# EAGLE design Antilog-NPNO (EAGLE 9.0.1)
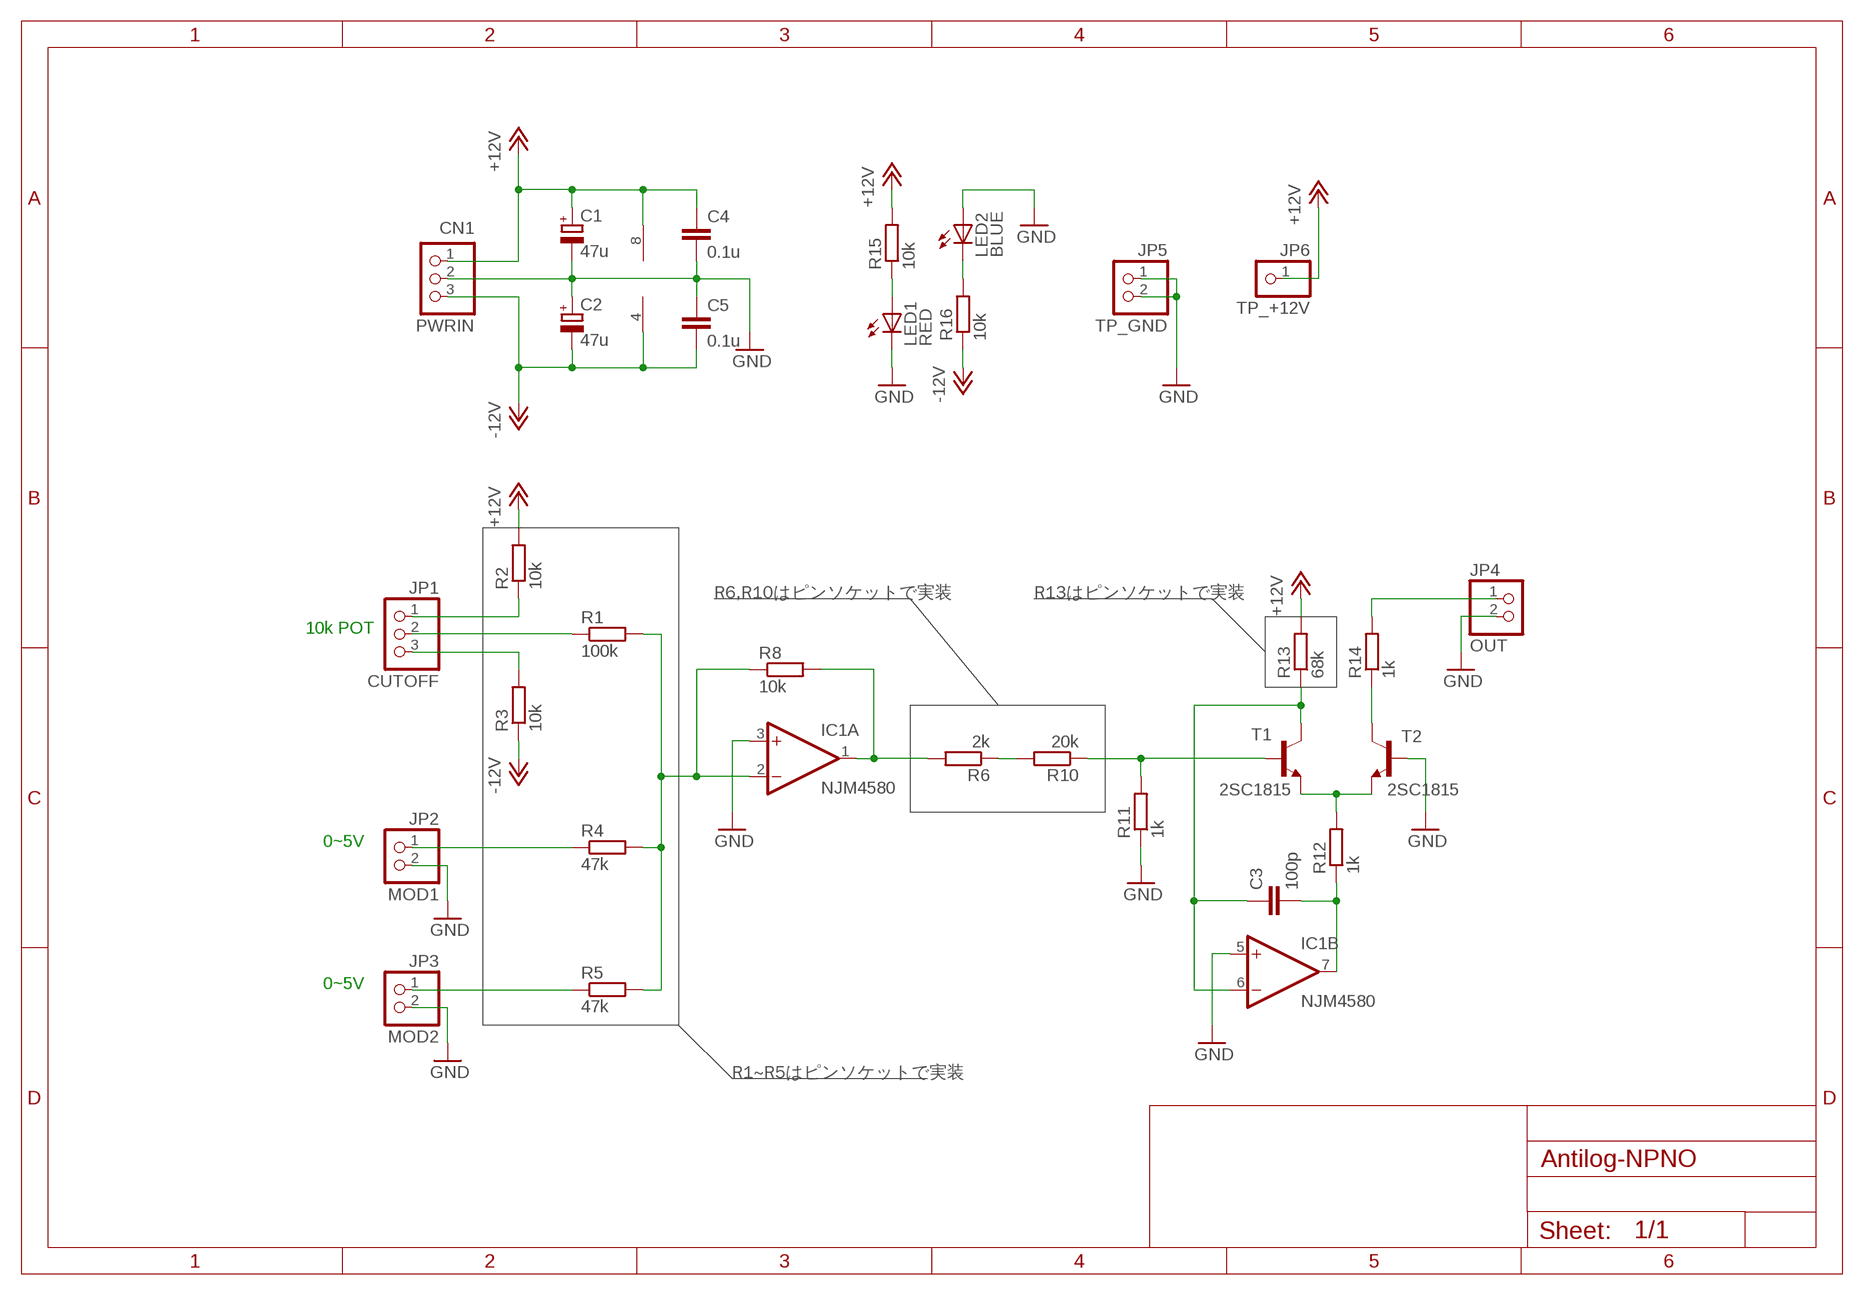
[diagram p0: schematic, sheet 1]

## Parts
C1  47u  CPOL-EUE2.5-6  [E2,5-6]
C2  47u  CPOL-EUE2.5-6  [E2,5-6]
C3  100p  C-EU050-024X044  [C050-024X044]
C4  0.1u  C-EU025-024X044  [C025-024X044]
C5  0.1u  C-EU025-024X044  [C025-024X044]
CN1  PWRIN  B3B-XH-A  [B3B-XH-A]
IC1  NJM4580  LM4558N  [DIL08]
JP1  CUTOFF  PINHD-1X3  [1X03]
JP2  MOD1  PINHD-1X2  [1X02]
JP3  MOD2  PINHD-1X2  [1X02]
JP4  OUT  PINHD-1X2  [1X02]
JP5  TP_GND  PINHD-1X2  [1X02]
JP6  TP_+12V  PINHD-1X1  [1X01]
LED1  RED  LED3MM  [LED3MM]
LED2  BLUE  LED3MM  [LED3MM]
R1  100k  R-EU_0207/7  [0207/7]
R2  10k  R-EU_0207/7  [0207/7]
R3  10k  R-EU_0207/7  [0207/7]
R4  47k  R-EU_0207/7  [0207/7]
R5  47k  R-EU_0207/7  [0207/7]
R6  2k  R-EU_0207/7  [0207/7]
R8  10k  R-EU_0207/7  [0207/7]
R10  20k  R-EU_0207/7  [0207/7]
R11  1k  R-EU_0207/7  [0207/7]
R12  1k  R-EU_0207/7  [0207/7]
R13  68k  R-EU_0207/7  [0207/7]
R14  1k  R-EU_0207/7  [0207/7]
R15  10k  R-EU_0207/7  [0207/7]
R16  10k  R-EU_0207/7  [0207/7]
T1  2SC1815  BC368-NPN-TO92-ECB  [TO92-ECB]
T2  2SC1815  BC368-NPN-TO92-ECB  [TO92-ECB]

## Nets
+12V: C1.+ C4.1 CN1.1 IC1.8(P:V+) JP6.1 R2.2 R13.2 R15.2
-12V: C2.- C5.2 CN1.3 IC1.4(P:V-) R3.1 R16.1
GND: C1.- C2.+ C4.2 C5.1 CN1.2 IC1.3(A:+IN) IC1.5(B:+IN) JP2.2 JP3.2 JP4.2 JP5.1 JP5.2 LED1.K(C) LED2.A R11.1 T2.B
N$1: JP3.1 R5.1
N$2: R10.1 R11.2 T1.B
N$3: JP1.2 R1.1
N$4: JP2.1 R4.1
N$5: IC1.1(A:OUT) R6.2 R8.2
N$6: R6.1 R10.2
N$7: JP1.1 R2.1
N$8: JP1.3 R3.2
N$9: IC1.2(A:-IN) R1.2 R4.2 R5.2 R8.1
N$10: R14.1 T2.C
N$11: LED1.A R15.1
N$13: JP4.1 R14.2
N$15: R12.2 T1.E T2.E
N$16: C3.2 IC1.7(B:OUT) R12.1
N$17: C3.1 IC1.6(B:-IN) R13.1 T1.C
N$19: LED2.K(C) R16.2

## Notes on the sheet
- R6,R10はピンソケットで実装 | R13はピンソケットで実装
- 10k POT
- 0~5V
- 0~5V
- R1~R5はピンソケットで実装

## Library data of the parts
C1 C2 = rcl:CPOL-EU: POLARIZED CAPACITOR, European symbol; SPICEPREFIX: C
C3-C5 = rcl:C-EU: CAPACITOR, European symbol; SPICEPREFIX: C
CN1 = jst-xh:B3B-XH-A: Wire-to-Board 2.5mm pitch top mount connector Source: http://www.jst-mfg.com/product/pdf/jpn/XH.pdf http://www.jst-mfg.com/product/detail.php?series=277
IC1 = linear:*4558: OP AMP
JP1 = pinhead:PINHD-1X3: PIN HEADER
JP2-JP5 = pinhead:PINHD-1X2: PIN HEADER
JP6 = pinhead:PINHD-1X1: PIN HEADER
LED1 LED2 = led:LED: LED OSRAM: - CHIPLED LG R971, LG N971, LY N971, LG Q971, LY Q971, LO R971, LY R971 LH N974, LH R974 LS Q976, LO Q976, LY Q976 LO Q996 - Hyper CHIPLED LW Q18S LB Q993, LB Q99A, LB R99A - SideLED LS A670, LO A670, LY A670, LG A670, LP A670 LB A673, LV A673, LT A673, LW A673 LH A674 LY A675 LS A676, LA A676, LO A676, LY A676, LW A676 LS A679, LY A679, LG A679 - Hyper Micro SIDELED® LS Y876, LA Y876, LO Y876, LY Y876 LT Y87S - SmartLED LW L88C, LW L88S LB L89C, LB L89S, LG L890 LS L89K, LO L89K, LY L89K LS L896, LA L896, LO L896, LY L896 - TOPLED LS T670, LO T670, LY T670, LG T670, LP T670 LSG T670, LSP T670, LSY T670, LOP T670, LYG T670 LG T671, LOG T671, LSG T671 LB T673, LV T673, LT T673, LW T673 LH T674 LS T676, LA T676, LO T676, LY T676, LB T676, LH T676, LSB T676, LW T676 LB T67C, LV T67C, LT T67C, LS T67K, LO T67K, LY T67K, LW E67C LS E67B, LA E67B, LO E67B, LY E67B, LB E67C, LV E67C, LT E67C LW T67C LS T679, LY T679, LG T679 LS T770, LO T770, LY T770, LG T770, LP T770 LB T773, LV T773, LT T773, LW T773 LH T774 LS E675, LA E675, LY E675, LS T675 LS T776, LA T776, LO T776, LY T776, LB T776 LHGB T686 LT T68C, LB T68C - Hyper Mini TOPLED® LB M676 - Mini TOPLED Santana® LG M470 LS M47K, LO M47K, LY M47K Source: http://www.osram.convergy.de LUXEON: - LUMILED® LXK2-PW12-R00, LXK2-PW12-S00, LXK2-PW14-U00, LXK2-PW14-V00 LXK2-PM12-R00, LXK2-PM12-S00, LXK2-PM14-U00 LXK2-PE12-Q00, LXK2-PE12-R00, LXK2-PE12-S00, LXK2-PE14-T00, LXK2-PE14-U00 LXK2-PB12-K00, LXK2-PB12-L00, LXK2-PB12-M00, LXK2-PB14-N00, LXK2-PB14-P00, LXK2-PB14-Q00 LXK2-PR12-L00, LXK2-PR12-M00, LXK2-PR14-Q00, LXK2-PR14-R00 LXK2-PD12-Q00, LXK2-PD12-R00, LXK2-PD12-S00 LXK2-PH12-R00, LXK2-PH12-S00 LXK2-PL12-P00, LXK2-PL12-Q00, LXK2-PL12-R00 Source: www.luxeon.com KINGBRIGHT: KA-3528ASYC Source: www.kingbright.com
R1-R6 R8 R10-R16 = rcl:R-EU_: RESISTOR, European symbol; SPICEPREFIX: R
T1 T2 = transistor-neu-to92:*-NPN-: NPN Transistror

## Board
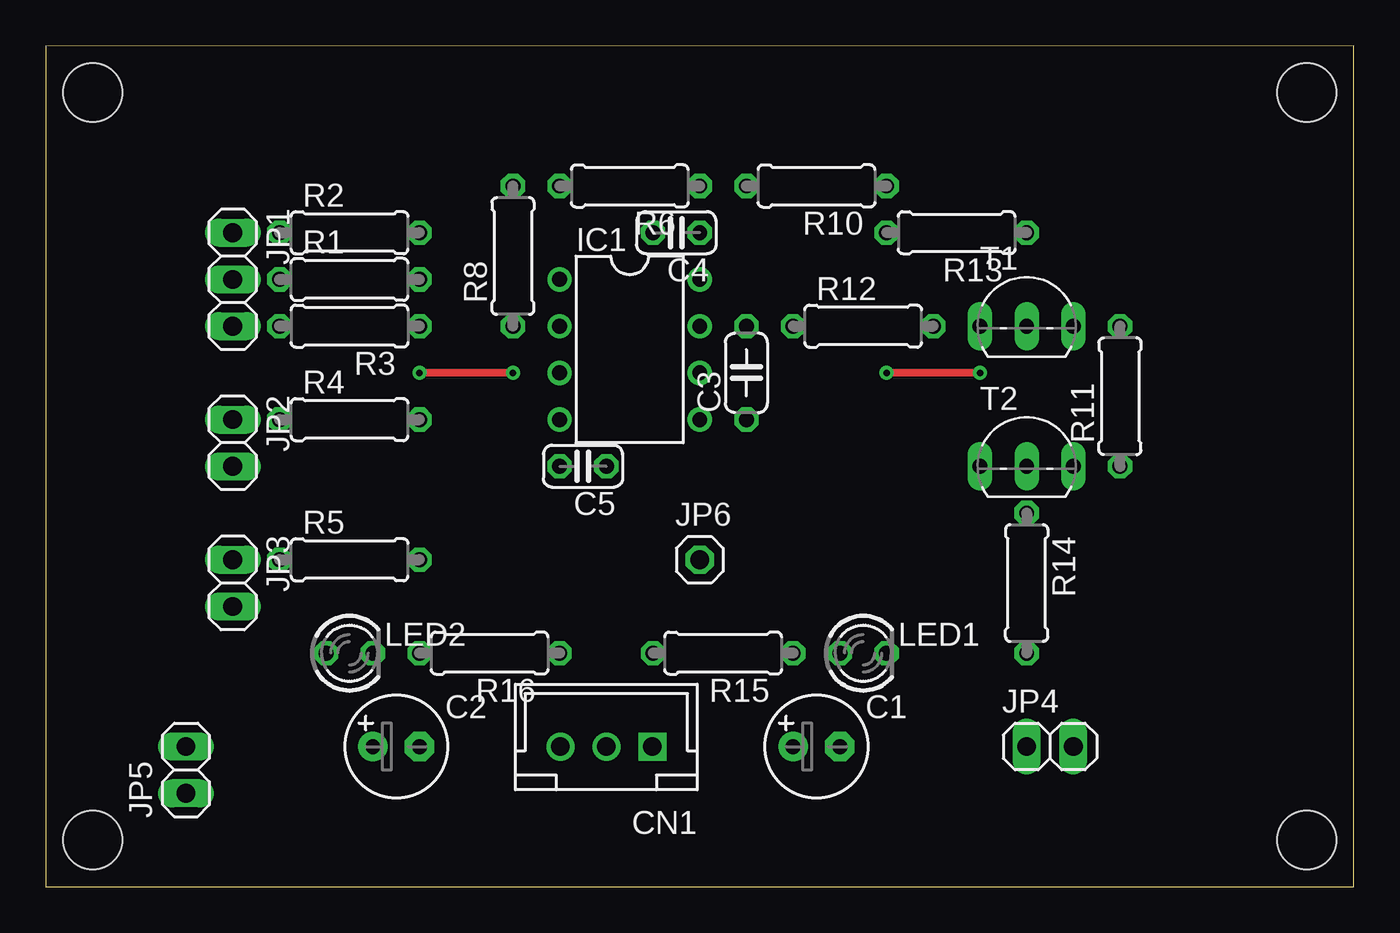
[diagram p1: board, top side]
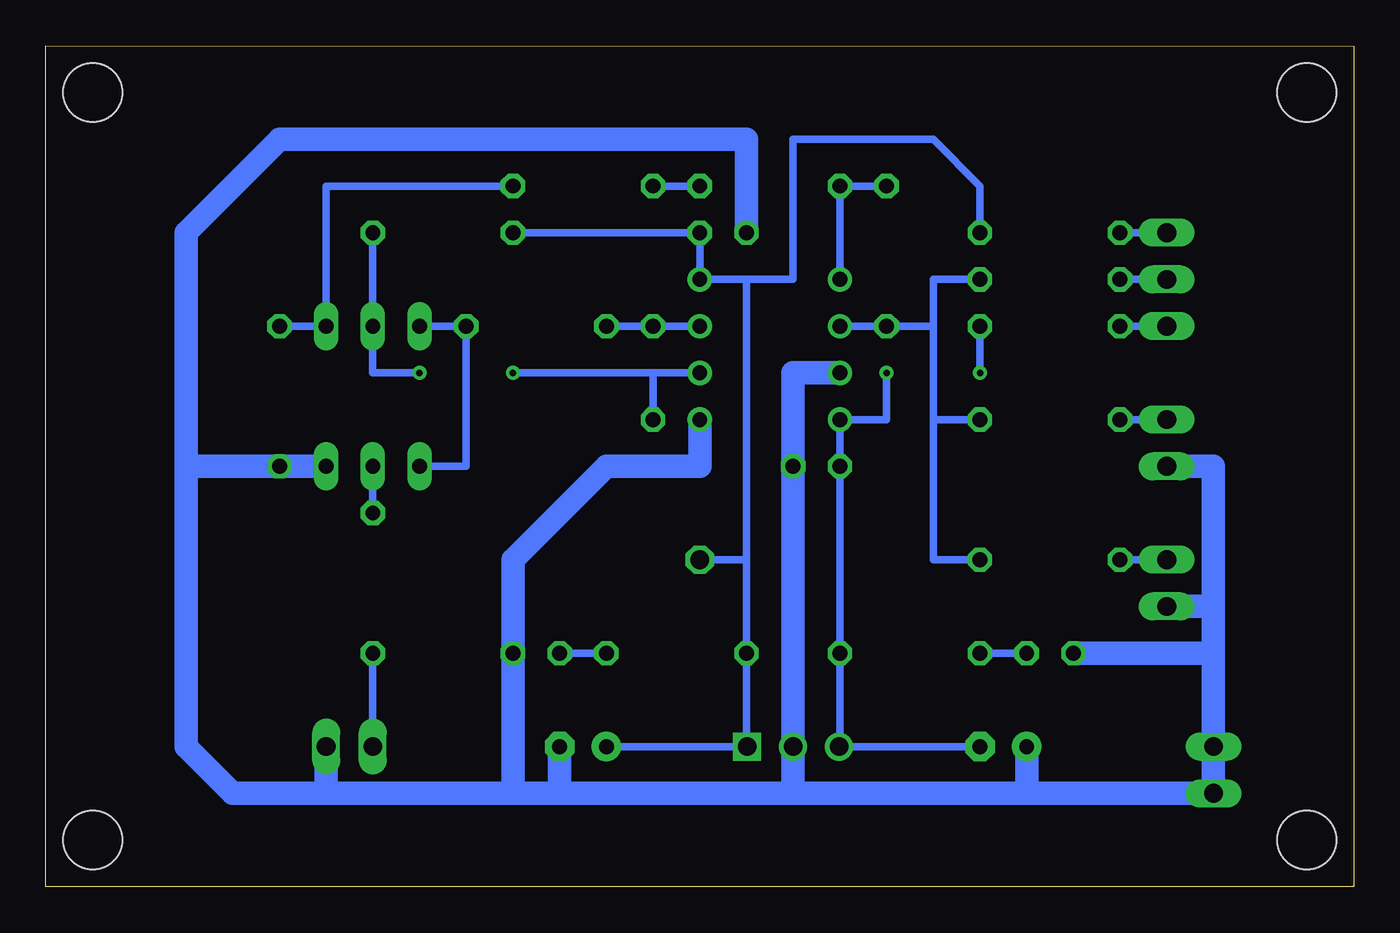
[diagram p2: board, bottom side, seen from below]

Size 71.12 x 45.71 mm. Coordinates in mm from the lower left corner, seen from the top.
Outline: 0,0 71.12,0 71.12,45.71 0,45.71 0,0
Copper layers (1*16): Top 0.035mm / dielectric 1.5mm / Bottom 0.035mm
Design rules "default": minimum track width 6mil, minimum drill 0.35mm, track to track 6mil, track to pad 6mil, pad to pad 6mil, via to via 6mil, smd to smd 6mil, copper to edge 40mil, drill to drill 6mil, minimum pad ring 10mil, minimum via ring 8mil, stop-mask expansion 4mil, vias tented up to drill 0mil, thermal gap 10mil
Holes 3.2 mm at 2.54,43.18 2.54,2.54 68.58,43.18 68.58,2.54

### Footprints (pad centres in the part's own frame; a part is rotated, then mirrored left to right if it is on the bottom)
E2,5-6 = drill 0.813 pad 1.6: + -1.27,0 | drill 0.813 pad 1.6 octagon: - 1.27,0
C050-024X044 = drill 0.813 octagon: 1 -2.54,0; 2 2.54,0
C025-024X044 = drill 0.813 octagon: 1 -1.27,0; 2 1.27,0
B3B-XH-A = drill 1.016 square: 1 -2.5,0 | drill 1.016: 2 0,0; 3 2.5,0
DIL08 = drill 0.813 pad 1.27: 1 -3.81,-3.81; 2 -1.27,-3.81; 3 1.27,-3.81; 4 3.81,-3.81; 5 3.81,3.81; 6 1.27,3.81; 7 -1.27,3.81; 8 -3.81,3.81
1X03 = drill 1.016 long: 1 -2.54,0; 2 0,0; 3 2.54,0
1X02 = drill 1.016 long: 1 -1.27,0; 2 1.27,0
1X01 = drill 1.016 octagon: 1 0,0
LED3MM = drill 0.813 octagon: A -1.27,0; K 1.27,0
0207/7 = drill 0.813 octagon: 1 -3.81,0; 2 3.81,0
TO92-ECB = drill 0.813 long: B 2.54,0; C 0,0; E -2.54,0

### Placement (x,y rotation side)
C1  41.91,7.62 0 top
C2  19.05,7.62 0 top
C3  38.1,27.94 90 top
C4  34.29,35.56 180 top
C5  29.21,22.86 180 top
CN1  30.48,7.62 180 top
IC1  31.75,29.21 270 top
JP1  10.16,33.02 270 top
JP2  10.16,24.13 270 top
JP3  10.16,16.51 270 top
JP4  54.61,7.62 0 top
JP5  7.62,6.35 90 top
JP6  35.56,17.78 0 top
LED1  44.45,12.7 0 top
LED2  16.51,12.7 0 top
R1  16.51,33.02 0 top
R2  16.51,35.56 0 top
R3  16.51,30.48 180 top
R4  16.51,25.4 0 top
R5  16.51,17.78 0 top
R6  31.75,38.1 180 top
R8  25.4,34.29 90 top
R10  41.91,38.1 180 top
R11  58.42,26.67 90 top
R12  44.45,30.48 0 top
R13  49.53,35.56 180 top
R14  53.34,16.51 270 top
R15  36.83,12.7 180 top
R16  24.13,12.7 180 top
T1  53.34,30.48 0 top
T2  53.34,22.86 0 top

### Tracks (layer width: path | path; a pad name or v marks a point on that pad's centre or on a via)
+12V
  Bottom 0.406: CN1.1 33.02,7.62 | 33.02,7.62 C1.+ | 33.02,7.62 R15.2 33.02,17.78 | 33.02,17.78 33.02,33.02 | 33.02,33.02 IC1.8 C4.1 R13.2 | R2.2 20.32,38.1 22.86,40.64 30.48,40.64 30.48,33.02 33.02,33.02 | JP6.1 33.02,17.78
-12V  (via drill 0.35)
  Top 0.406: v20.32,27.94 v25.4,27.94
  Bottom 0.406: R3.1 v20.32,27.94 | v25.4,27.94 25.4,25.4 IC1.4 C5.2 R16.1 27.94,7.62 CN1.3 C2.-
GND
  Bottom 1.27: 30.48,5.08 CN1.2 C5.1 30.48,27.94 IC1.3 | 30.48,5.08 17.78,5.08 | 17.78,5.08 JP5.1 JP5.2 7.62,12.7 | C2.+ 17.78,5.08 | C1.- 43.18,5.08 | 43.18,5.08 30.48,5.08 | JP2.2 7.62,22.86 7.62,15.24 | 7.62,15.24 JP3.2 | LED2.A 7.62,12.7 | JP4.2 55.88,5.08 | 55.88,5.08 45.72,5.08 | 45.72,5.08 43.18,5.08 | 63.5,22.86 R11.1 T2.B | C4.2 33.02,40.64 58.42,40.64 63.5,35.56 63.5,22.86 | 55.88,5.08 60.96,5.08 63.5,7.62 63.5,22.86 | 45.72,5.08 LED1.K 45.72,17.78 40.64,22.86 35.56,22.86 IC1.5 | 7.62,15.24 7.62,12.7
N$1
  Bottom 0.406: JP3.1 R5.1
N$2
  Bottom 0.406: R10.1 55.88,38.1 T1.B R11.2
N$3
  Bottom 0.406: JP1.2 R1.1
N$4
  Bottom 0.406: JP2.1 R4.1
N$5
  Bottom 0.406: IC1.1 R6.2 R8.2
N$6
  Bottom 0.406: R6.1 R10.2
N$7
  Bottom 0.406: JP1.1 R2.1
N$8
  Bottom 0.406: JP1.3 R3.2
N$9
  Bottom 0.406: IC1.2 R8.1 22.86,30.48 | R1.2 22.86,33.02 22.86,30.48 | 22.86,30.48 22.86,25.4 | 22.86,25.4 22.86,17.78 R5.2 | R4.2 22.86,25.4
N$10
  Bottom 0.406: T2.C R14.1
N$11
  Bottom 0.406: R15.1 LED1.A
N$13
  Bottom 0.406: R14.2 JP4.1
N$15
  Bottom 0.406: T2.E 48.26,22.86 R12.2 T1.E
N$16
  Bottom 0.406: IC1.7 C3.2 R12.1
N$17  (via drill 0.35)
  Top 0.406: v45.72,27.94 v50.8,27.94
  Bottom 0.406: IC1.6 38.1,27.94 | R13.1 T1.C 53.34,27.94 v50.8,27.94 | C3.1 38.1,27.94 | 38.1,27.94 v45.72,27.94
N$19
  Bottom 0.406: LED2.K R16.2

### Text on the board
tDocu: Antilog-NPNO | http://dad8893.blogspot.com/
Pinsocket: はピンソケットで実装